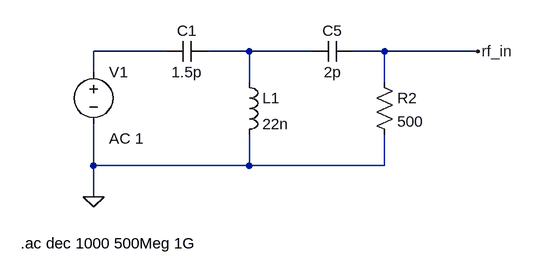
[diagram p0: schematic max4003_matching.asc]
max4003_matching.asc, the LTspice schematic file:
Version 4
SHEET 1 880 680
WIRE 0 224 -112 224
WIRE 128 224 64 224
WIRE 224 224 128 224
WIRE 336 224 288 224
WIRE 480 224 336 224
WIRE -112 256 -112 224
WIRE 128 272 128 224
WIRE 336 272 336 224
WIRE -112 400 -112 336
WIRE 128 400 128 352
WIRE 128 400 -112 400
WIRE 336 400 336 352
WIRE 336 400 128 400
WIRE -112 448 -112 400
FLAG -112 448 0
FLAG 480 224 rf_in
SYMBOL voltage -112 240 R0
WINDOW 123 24 118 Left 2
SYMATTR Value2 AC 1
SYMATTR InstName V1
SYMATTR Value ""
SYMBOL cap 64 208 R90
WINDOW 0 0 32 VBottom 2
WINDOW 3 32 32 VTop 2
SYMATTR InstName C1
SYMATTR Value 1.5p
SYMBOL ind 112 256 R0
SYMATTR InstName L1
SYMATTR Value 22n
SYMBOL res 320 256 R0
SYMATTR InstName R2
SYMATTR Value 500
SYMBOL cap 224 240 R270
WINDOW 0 32 32 VTop 2
WINDOW 3 0 32 VBottom 2
SYMATTR InstName C5
SYMATTR Value 2p
TEXT -224 520 Left 2 !.ac dec 1000 500Meg 1G

The netlist it stands for:
* max4003_matching.asc
V1 N001 0 AC 1
C1 N002 N001 1.5p
L1 N002 0 22n
R2 rf_in 0 500
C5 N002 rf_in 2p
.ac dec 1000 500Meg 1G
.backanno
.end